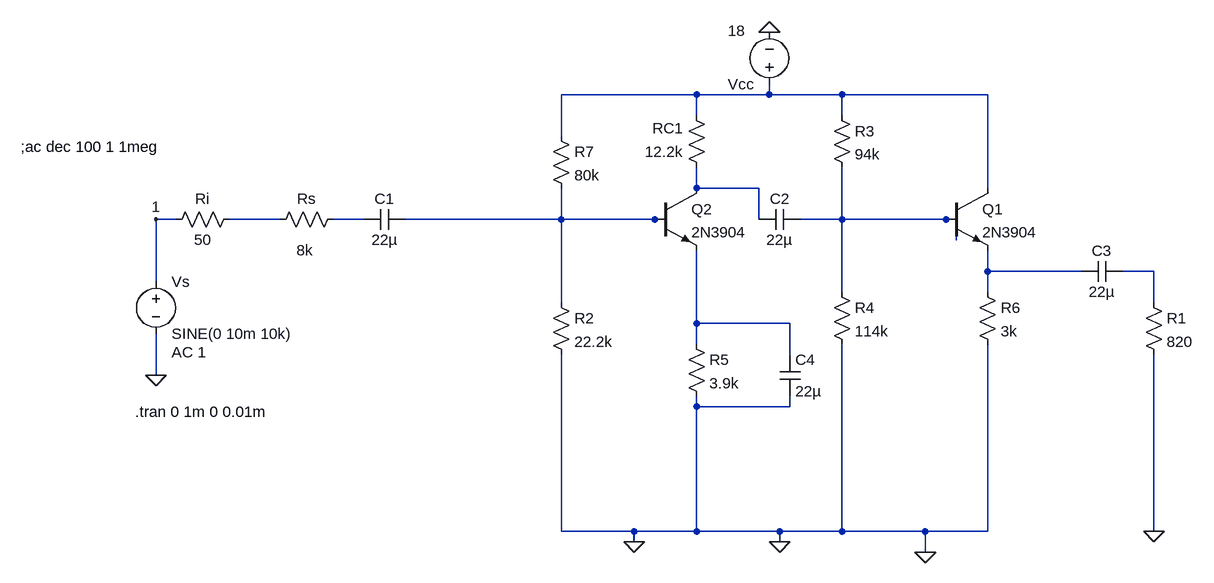
[diagram p0: schematic schemeaticNMOS (1).asc]
schemeaticNMOS (1).asc, the LTspice schematic file:
Version 4
SHEET 1 1636 708
WIRE 224 -16 16 -16
WIRE 336 -16 336 -32
WIRE 336 -16 224 -16
WIRE 448 -16 336 -16
WIRE 672 -16 448 -16
WIRE 224 16 224 -16
WIRE 448 16 448 -16
WIRE 16 48 16 -16
WIRE 224 128 224 96
WIRE 320 128 224 128
WIRE 672 128 672 -16
WIRE -576 176 -608 176
WIRE -416 176 -496 176
WIRE -288 176 -336 176
WIRE 16 176 16 128
WIRE 16 176 -224 176
WIRE 160 176 16 176
WIRE 176 176 160 176
WIRE 320 176 320 128
WIRE 448 176 448 96
WIRE 448 176 384 176
WIRE 608 176 448 176
WIRE 624 176 608 176
WIRE 624 208 624 176
WIRE 672 256 672 224
WIRE 816 256 672 256
WIRE 928 256 880 256
WIRE -608 272 -608 176
WIRE 448 288 448 176
WIRE 672 288 672 256
WIRE 16 304 16 176
WIRE 928 304 928 256
WIRE 224 336 224 224
WIRE 368 336 224 336
WIRE 224 368 224 336
WIRE 368 384 368 336
WIRE -608 416 -608 352
WIRE 224 464 224 448
WIRE 368 464 368 448
WIRE 368 464 224 464
WIRE 16 656 16 384
WIRE 128 656 16 656
WIRE 224 656 224 464
WIRE 224 656 128 656
WIRE 352 656 224 656
WIRE 448 656 448 368
WIRE 448 656 352 656
WIRE 576 656 448 656
WIRE 672 656 672 368
WIRE 672 656 576 656
WIRE 928 656 928 384
WIRE 128 672 128 656
WIRE 352 672 352 656
WIRE 576 688 576 656
FLAG -608 416 0
FLAG 352 672 0
FLAG -608 176 1
FLAG 928 656 0
FLAG 128 672 0
FLAG 576 688 0
FLAG 336 -112 0
SYMBOL res 0 288 R0
SYMATTR InstName R2
SYMATTR Value 22.2k
SYMBOL res 240 112 R180
WINDOW 0 36 76 Left 2
WINDOW 3 36 40 Left 2
SYMATTR InstName RC1
SYMATTR Value 12.2k
SYMBOL res -480 160 R90
WINDOW 0 0 56 VBottom 2
WINDOW 3 32 56 VTop 2
SYMATTR InstName Ri
SYMATTR Value 50
SYMBOL cap 384 160 R90
WINDOW 0 0 32 VBottom 2
WINDOW 3 32 32 VTop 2
SYMATTR InstName C2
SYMATTR Value 22µ
SYMBOL res 432 0 R0
SYMATTR InstName R3
SYMATTR Value 94k
SYMBOL res 432 272 R0
SYMATTR InstName R4
SYMATTR Value 114k
SYMBOL res 656 272 R0
SYMATTR InstName R6
SYMATTR Value 3k
SYMBOL voltage -608 256 R0
WINDOW 123 24 124 Left 2
WINDOW 39 0 0 Left 0
SYMATTR Value2 AC 1
SYMATTR InstName Vs
SYMATTR Value SINE(0 10m 10k)
SYMBOL cap -224 160 R90
WINDOW 0 0 32 VBottom 2
WINDOW 3 32 32 VTop 2
SYMATTR InstName C1
SYMATTR Value 22µ
SYMBOL voltage 336 -16 R180
WINDOW 123 0 0 Left 0
WINDOW 39 0 0 Left 0
WINDOW 3 37 98 Left 2
SYMATTR InstName Vcc
SYMATTR Value 18
SYMBOL res -320 160 R90
WINDOW 0 0 56 VBottom 2
WINDOW 3 48 59 VTop 2
SYMATTR InstName Rs
SYMATTR Value 8k
SYMBOL res 208 352 R0
SYMATTR InstName R5
SYMATTR Value 3.9k
SYMBOL cap 352 384 R0
SYMATTR InstName C4
SYMATTR Value 22µ
SYMBOL npn 608 128 R0
SYMATTR InstName Q1
SYMATTR Value 2N3904
SYMBOL npn 160 128 R0
SYMATTR InstName Q2
SYMATTR Value 2N3904
SYMBOL res 0 32 R0
SYMATTR InstName R7
SYMATTR Value 80k
SYMBOL cap 880 240 R90
WINDOW 0 0 32 VBottom 2
WINDOW 3 32 32 VTop 2
SYMATTR InstName C3
SYMATTR Value 22µ
SYMBOL res 912 288 R0
SYMATTR InstName R1
SYMATTR Value 820
TEXT -640 472 Left 2 !.tran 0 1m 0 0.01m
TEXT -816 64 Left 2 !;ac dec 100 1 1meg

The netlist it stands for:
* schemeaticNMOS (1).asc
R2 N005 0 22.2k
RC1 N002 N001 12.2k
Ri N003 1 50
C2 N006 N002 22µ
R3 N001 N006 94k
R4 N006 0 114k
R6 N007 0 3k
Vs 1 0 SINE(0 10m 10k) AC 1
C1 N005 N004 22µ
Vcc N001 0 18
Rs N004 N003 8k
R5 N009 0 3.9k
C4 N009 0 22µ
Q1 N001 N006 N007 0 2N3904
Q2 N002 N005 N009 0 2N3904
R7 N001 N005 80k
C3 N008 N007 22µ
R1 N008 0 820
.model NPN NPN
.model PNP PNP
.lib standard.bjt
.tran 0 1m 0 0.01m
;ac dec 100 1 1meg
.backanno
.end